# EAGLE design butt_blaster_mk_3 (EAGLE 6.5.0)
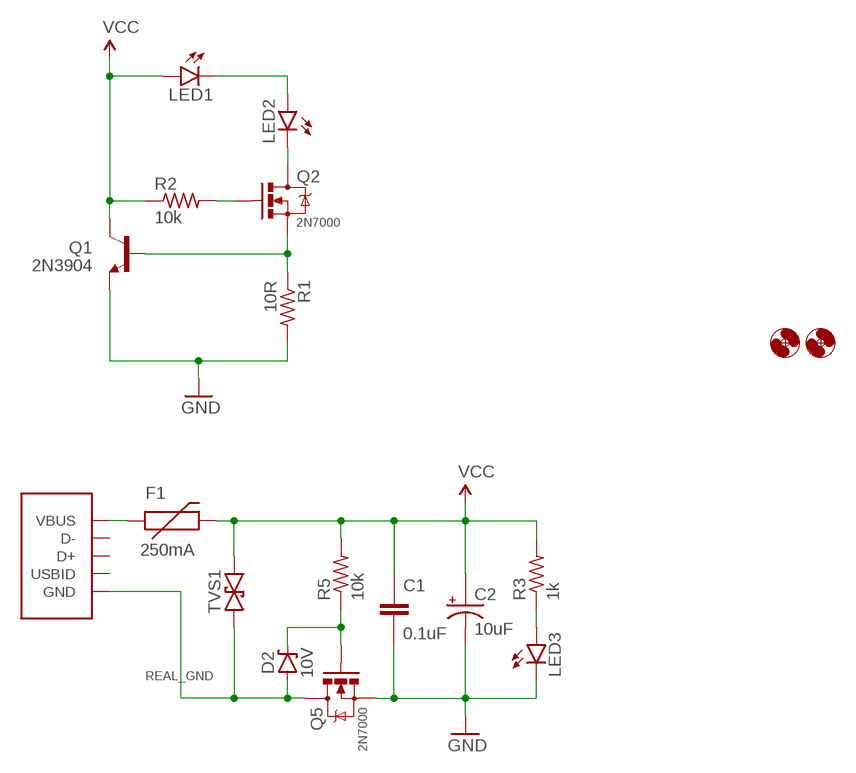
[diagram p0: schematic, sheet 1]

## Parts
C1  0.1uF  CAPACITOR-CERAMIC025-024X044  [C025-024X044]
C2  10uF  CAPACITOR-POLARIZEDE2.5-6  [E2,5-6]
D2  10V  DIODE-ZENERPTH-7.68MM  [DIODE-7.68MM]
F1  250mA  PTCPTH  [PTC]
H1  HOLE#2  [HOLE-#2]
H2  HOLE#2  [HOLE-#2]
LED1  LED5MM_SHORTPADS  [LED5MM_SHORTPADS]
LED2  LED5MM_SHORTPADS  [LED5MM_SHORTPADS]
LED3  LED3MM  [LED3MM]
PWR  USB-ABCOMBO  [USB-MICRO-B-FCI-CUTOUT]
Q1  2N3904  TRANSISTOR_NPNTO-92-AMMO-EBC  [TO-92-AMMO]
Q2  2N7000  MOSFET-NCHANNEL2N7000-AMMO  [TO-92-AMMO]
Q5  2N7000  MOSFET-NCHANNEL2N7000-AMMO  [TO-92-AMMO]
R1  10R  RESISTORPTH-AXIAL-10.16MM  [RESISTOR-AXIAL-PTH-10.16MM]
R2  10k  RESISTORPTH-AXIAL-6.35MM  [RESISTOR-AXIAL-PTH-6.35MM]
R3  1k  RESISTORPTH-AXIAL-6.35MM  [RESISTOR-AXIAL-PTH-6.35MM]
R5  10k  RESISTORPTH-AXIAL-7.68MM  [RESISTOR-AXIAL-PTH-7.68MM]
TVS1  TVSDO-41-TVS-BIDIRECTIONAL  [DO-41-TVS]

## Nets
GND: C1.2 C2.- LED3.K(C) Q1.1(E) Q5.1(S) R1.P$2
N$1: LED1.K(C) LED2.A
N$2: LED3.A R3.P$1
N$3: LED2.K(C) Q2.3(D)
N$4: F1.P$1 PWR.1(VBUS)
N$5: D2.K(C) Q5.2(G) R5.P$1
N$6: Q1.2(B) Q2.1(S) R1.P$1
N$8: Q2.2(G) R2.P$2
REAL_GND: D2.A PWR.5(GND) PWR.P$1(GND) PWR.P$2(GND) Q5.3(D) TVS1.P$1
VCC: C1.1 C2.+ F1.P$2 LED1.A Q1.3(C) R2.P$1 R3.P$2 R5.P$2 TVS1.P$2
Unconnected: PWR.2(D-) PWR.3(D+) PWR.4(USBID)

## Library data of the parts
C1 = A_butts:CAPACITOR-CERAMIC: CAPACITOR, European symbol
C2 = A_butts:CAPACITOR-POLARIZED: POLARIZED CAPACITOR, American symbol
D2 = A_butts:DIODE-ZENER: Zener Diode Production Part - 8199 3.4V Zener Voltage
F1 = A_butts:PTC: Resettable Fuse PTC Resettable Fuse. Spark Fun Electronics SKU : COM-08357
H1 H2 = A_butts:HOLE: MOUNTING HOLE with drill center marker
LED1-LED3 = A_butts:LED: LEDs Standard schematic elements and footprints for 5mm, 3mm, 1206, and 0603 sized LEDs. 5mm - Spark Fun Electronics SKU : COM-00529 (and others)
PWR = A_butts:USB-AB: This is a USB AB connector that is compatible with USB OTG. i.e. this connector can serve as a host or device
Q1 = A_butts:TRANSISTOR_NPN: Generic NPN BJT MMBT2222A - TRANS-08049 (SOT-23, 1A 40V) MPSA42 - TRANS-09116 (SOT-23, 500mA 300V) MMBT5088LT1G - TRANS-11160 (SOT-23, 50 mA 30V) BC547 - COM-08928 <http://www.sparkfun.com/products/8928> (TO-92 45V 100mA) (1.Collector 2.Base 3.Emitter) 2N3904 - COM-00521 <http://www.sparkfun.com/products/521> (TO-92 40V 200mA) (1.Emitter 2.Base 3.Collector) P2N2222A - COM-12852 <http://www.sparkfun.com/products/12852> (TO-92 40V 600mA) (1.Collector 2.Base 3.Emitter)
Q2 Q5 = A_butts:MOSFET-NCHANNEL: Common NMOSFET Parts MFG P/N Store ID Prod ID FDD8780 TRANS-09984 SI7820DN TRANS-11055 FDS6630A IC-08089 2N7002PW TRANS-11151 FQP30N06L COM-10213 TRANS-10060 BSS123LT1G TRANS-08345 BSS138 TRANS-00830 BS170 2N7000
R1-R3 R5 = A_butts:RESISTOR: RESISTOR, American symbol
TVS1 = A_butts:TVS: Transient voltage suppressor- prevents ESD on inputs. Ignore package description- MBRA140 is NOT this type of part!!!

## Board
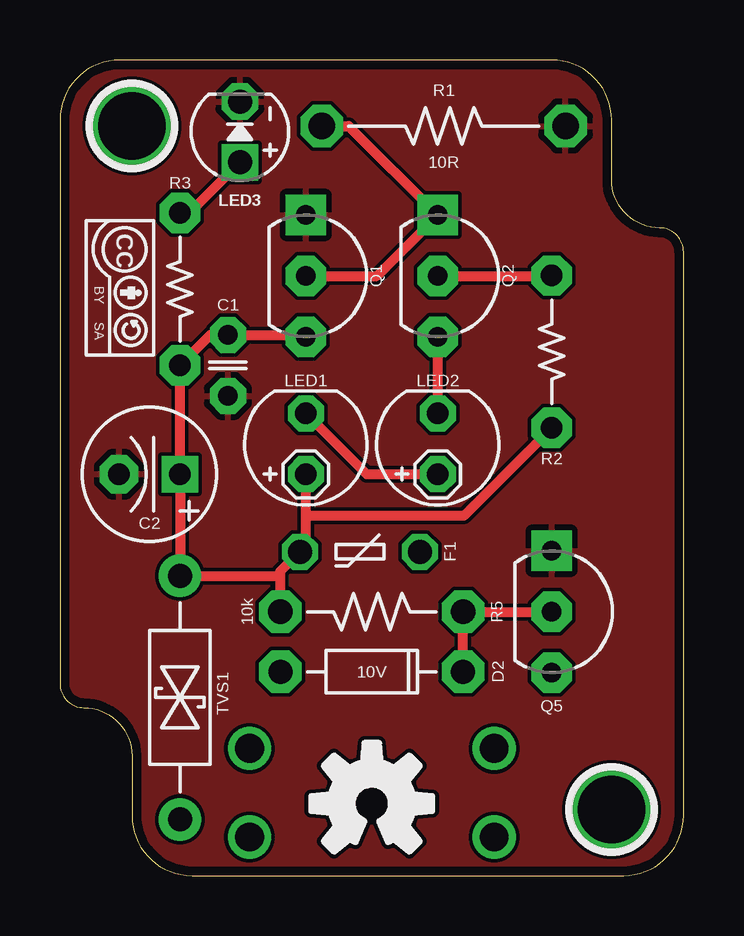
[diagram p1: board, top side]
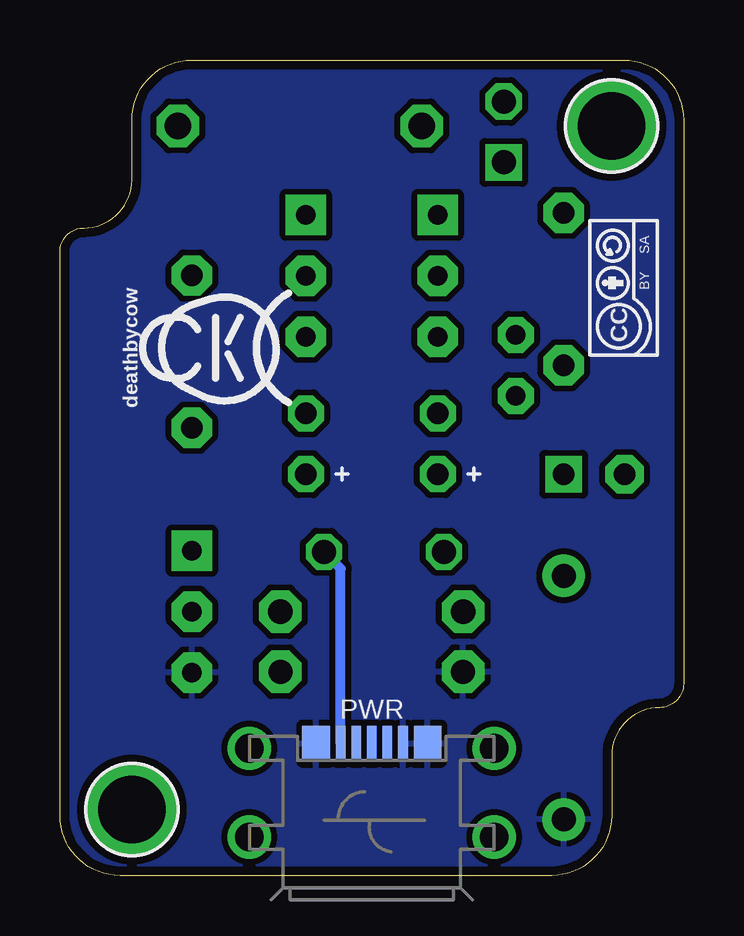
[diagram p2: board, bottom side, seen from below]

Size 26 x 34 mm. Coordinates in mm from the lower left corner, seen from the top.
Outline: 0,31.5 0,8 arc90 1,7 arc-90 3,5 3,2.5 arc90 5.5,0 23.5,0 arc90 26,2.5 26,26 arc90 25,27 arc-90 23,29 23,31.5 arc90 20.5,34 2.5,34 arc90 0,31.5
Copper layers (1*16): Top 0.0356mm / dielectric 1.5011mm / Bottom 0.0356mm
Design rules "LaenPCBOrder_2": minimum track width 6mil, minimum drill 13mil, track to track 6mil, track to pad 6mil, pad to pad 6mil, via to via 6mil, smd to smd 6mil, copper to edge 15mil, drill to drill 6mil, minimum pad ring 7mil, minimum via ring 7mil, stop-mask expansion 3mil, vias tented up to drill 20mil, thermal gap 10mil

### Footprints (pad centres in the part's own frame; a part is rotated, then mirrored left to right if it is on the bottom)
C025-024X044 = drill 0.813 pad 1.5 octagon: 1 -1.27,0; 2 1.27,0
E2,5-6 = drill 0.9 pad 1.524 square: + -1.27,0 | drill 0.9 pad 1.6 octagon: - 1.27,0
DIODE-7.68MM = drill 1 pad 1.778 octagon: A -3.81,0; K 3.81,0
PTC = drill 1 pad 1.5 octagon: P$1 -2.5,0; P$2 2.5,0
HOLE-#2 = drill 2.8 pad 3.81: P$1 0,0
LED5MM_SHORTPADS = drill 0.9 pad 1.5 octagon: A -1.27,0; K 1.27,0
LED3MM = drill 1 pad 1.524 square: A -1.27,0 | drill 1 pad 1.524 octagon: K 1.27,0
USB-MICRO-B-FCI-CUTOUT = smd 0.4 x 1.5: 1 -1.3,0; 2 -0.65,0; 3 0,0; 4 0.65,0; 5 1.3,0 | smd 1.15 x 1.5: P$1 -2.325,0; P$2 2.325,0 | drill 1.2: P$3 -5.1,-0.2; P$4 5.1,-0.2; P$5 -5.1,-3.9; P$6 5.1,-3.9
TO-92-AMMO = drill 0.813 pad 1.676 square: 1 -2.54,0 | drill 0.813 pad 1.676 octagon: 2 0,0; 3 2.54,0
RESISTOR-AXIAL-PTH-10.16MM = drill 1.1 pad 1.778 octagon: P$1 -5.08,0; P$2 5.08,0
RESISTOR-AXIAL-PTH-6.35MM = drill 0.9 pad 1.676 octagon: P$1 -3.175,0; P$2 3.175,0
RESISTOR-AXIAL-PTH-7.68MM = drill 1.016 pad 1.778 octagon: P$1 -3.81,0; P$2 3.81,0
DO-41-TVS = drill 1 pad 1.778: P$1 -5.08,0; P$2 5.08,0

### Placement (x,y rotation side)
C1  7,21.27 270 top
C2  3.73,16.73 180 top
D2  13,8.5 0 top
F1  12.5,13.5 180 top
H1  3,31.25 0 top
H2  23,2.75 0 top
LED1  10.25,18 90 top
LED2  15.75,18 90 top
LED3  7.5,31 90 top
PWR  13,5.5 0 bottom
Q1  10.25,25 270 top
Q2  15.75,25 270 top
Q5  20.5,11 270 top
R1  16,31.25 0 top
R2  20.5,21.84 90 top
R3  5,24.45 270 top
R5  13,11 180 top
TVS1  5,7.42 90 top
U$2  [COW_SMALL]  19,22 270 bottom
U$3  [CC-BY-SA-4.0-NO-URL]  2.5,24.5 270 top
U$4  [CC-BY-SA-4.0-NO-URL]  2.5,24.5 90 bottom
U$5  [OSHWLOGO_TOP_0.2_A]  13,3 0 top

### Tracks (layer width: path | path; a pad name or v marks a point on that pad's centre or on a via)
GND
  pour Top: 23.5,0 5.5,0 arc-90 3,2.5 3,4 3,5 arc90 1,7 arc-90 0,8 0,31.5 arc-90 2.5,34 20.5,34 arc-90 23,31.5 23,30 23,29 arc90 25,27 arc-90 26,26 26,2.5 arc-90
N$1
  Top 0.406: LED1.K 12.79,16.73 LED2.A
N$2
  Top 0.406: R3.P$1 5.39,27.62 LED3.A
N$3
  Top 0.406: LED2.K Q2.3
N$4
  Bottom 0.406: PWR.1 14.3,12.8 F1.P$1
N$5
  Top 0.406: D2.K R5.P$1 Q5.2
N$6
  Top 0.406: Q1.2 13.21,25 Q2.1 12.04,31.25 R1.P$1
N$8
  Top 0.406: Q2.2 20.49,25 R2.P$2
REAL_GND
  Bottom 0.406: 10.69,5.51 PWR.P$2
  pour Bottom (isolate 0.254): 23.5,0 5.5,0 arc-90 3,2.5 3,4 3,5 arc90 1,7 arc-90 0,8 0,31.5 arc-90 2.5,34 20.5,34 arc-90 23,31.5 23,30 23,29 arc90 25,27 arc-90 26,26 26,2.5 arc-90
VCC
  Top 0.406: R5.P$2 9.19,12.5 | 9.19,12.5 9.19,12.69 F1.P$2 10.25,13.75 10.25,15 | 10.25,15 LED1.A | 9.19,12.5 TVS1.P$2 C2.+ R3.P$2 6.26,22.54 C1.1 10.17,22.54 Q1.3 | R2.P$1 16.84,15 10.25,15